# Altium schematic sheet amplify.SchDoc
size A4
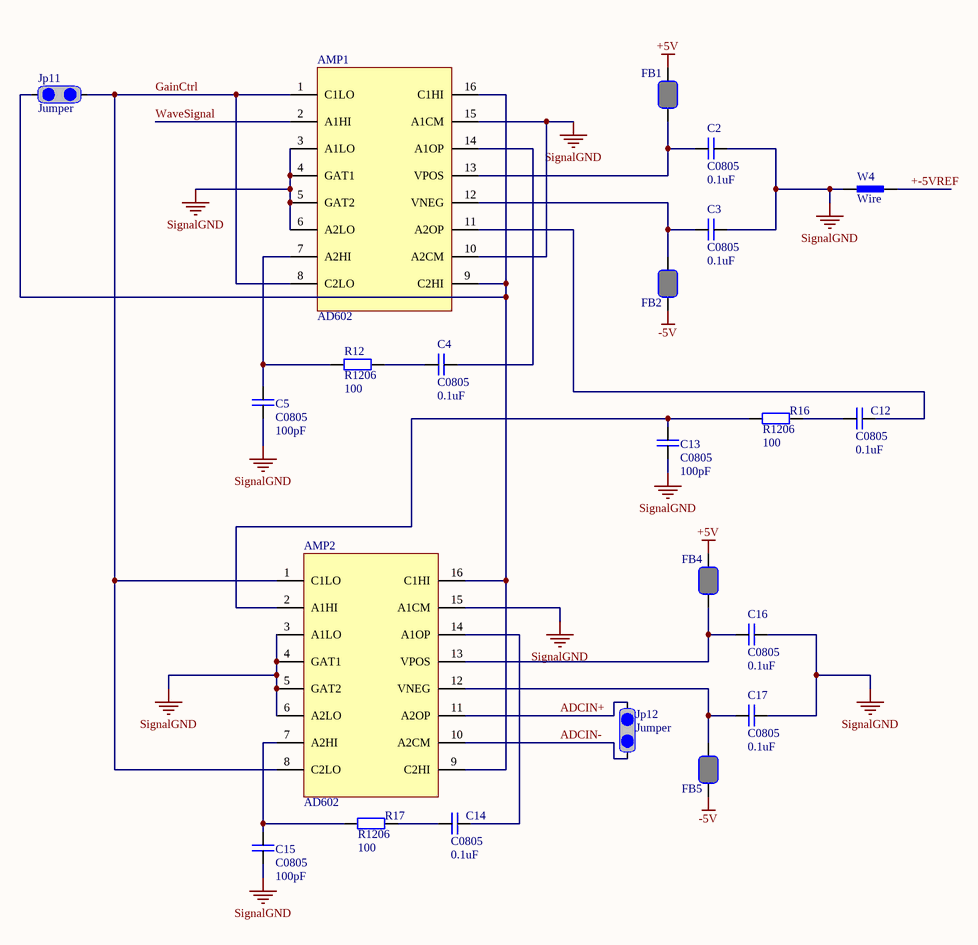
[diagram p0: amplify.SchDoc]

## Parts
AMP1  AD602  [SOP16]
AMP2  AD602  [SOP16]
C2  C0805  value 0.1uF  [0805]
C3  C0805  value 0.1uF  [0805]
C4  C0805  value 0.1uF  [0805]
C5  C0805  value 100pF  [0805]
C12  C0805  value 0.1uF  [0805]
C13  C0805  value 100pF  [0805]
C14  C0805  value 0.1uF  [0805]
C15  C0805  value 100pF  [0805]
C16  C0805  value 0.1uF  [0805]
C17  C0805  value 0.1uF  [0805]
FB1  FB0805  [0805]  (value not drawn)
FB2  FB0805  [0805]  (value not drawn)
FB4  FB0805  [0805]  (value not drawn)
FB5  FB0805  [0805]  (value not drawn)
Jp11  Jumper  [JUMPER]
Jp12  Jumper  [JUMPER]
R12  R1206  value 100  [1206]
R16  R1206  value 100  [1206]
R17  R1206  value 100  [1206]
W4  Wire  [WIRE]

## Nets
+5V: FB1.2(b) FB4.2(b)
-5V: FB2.1(a) FB5.1(a)
SignalGND: AMP1.3(A1LO) AMP1.4(GAT1) AMP1.5(GAT2) AMP1.6(A2LO) AMP1.10(A2CM) AMP1.15(A1CM) AMP2.3(A1LO) AMP2.4(GAT1) AMP2.5(GAT2) AMP2.6(A2LO) AMP2.15(A1CM) C2.2(b) C3.2(b) C5.1(a) C13.1(a) C15.1(a) C16.2(b) C17.2(b) W4.1(a)
+-5VREF: W4.2(b)
ADCIN+: AMP2.11(A2OP) Jp12.2(b)
ADCIN-: AMP2.10(A2CM) Jp12.1(a)
GainCtrl: AMP1.1(C1LO) AMP1.8(C2LO) AMP2.1(C1LO) AMP2.8(C2LO) Jp11.2(b)
WaveSignal: AMP1.2(A1HI)
NetAMP1_7: AMP1.7(A2HI) C5.2(b) R12.1(a)
NetAMP1_9: AMP1.9(C2HI) AMP1.16(C1HI) AMP2.9(C2HI) AMP2.16(C1HI) Jp11.1(a)
NetAMP1_11: AMP1.11(A2OP) C12.2(b)
NetAMP1_12: AMP1.12(VNEG) C3.1(a) FB2.2(b)
NetAMP1_13: AMP1.13(VPOS) C2.1(a) FB1.1(a)
NetAMP1_14: AMP1.14(A1OP) C4.2(b)
NetAMP2_2: AMP2.2(A1HI) C13.2(b) R16.1(a)
NetAMP2_7: AMP2.7(A2HI) C15.2(b) R17.1(a)
NetAMP2_12: AMP2.12(VNEG) C17.1(a) FB5.2(b)
NetAMP2_13: AMP2.13(VPOS) C16.1(a) FB4.1(a)
NetAMP2_14: AMP2.14(A1OP) C14.2(b)
NetC4_1: C4.1(a) R12.2(b)
NetC12_1: C12.1(a) R16.2(b)
NetC14_1: C14.1(a) R17.2(b)

## Library data of the parts
C2-C5 C12-C17 = C0805: Capacitor, 0805
FB1 FB2 FB4 FB5 = FB0805: Chip Bead, 0805
R12 R16 R17 = R1206: Resistor, 1206, 1/4W